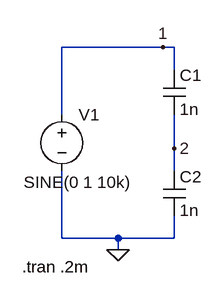
[diagram p0: schematic Fig_1-13_DC_float.asc]
Fig_1-13_DC_float.asc, the LTspice schematic file:
Version 4
SHEET 1 880 680
WIRE 224 16 80 16
WIRE 240 16 224 16
WIRE 240 48 240 16
WIRE 80 112 80 16
WIRE 240 160 240 112
WIRE 240 192 240 160
WIRE 80 288 80 192
WIRE 160 288 80 288
WIRE 240 288 240 256
WIRE 240 288 160 288
WIRE 160 304 160 288
FLAG 160 304 0
FLAG 224 16 1
FLAG 240 160 2
SYMBOL voltage 80 96 R0
WINDOW 3 -54 112 Left 2
WINDOW 123 0 0 Left 2
WINDOW 39 0 0 Left 2
SYMATTR Value SINE(0 1 10k)
SYMATTR InstName V1
SYMBOL cap 224 48 R0
SYMATTR InstName C1
SYMATTR Value 1n
SYMBOL cap 224 192 R0
SYMATTR InstName C2
SYMATTR Value 1n
TEXT 24 328 Left 2 !.tran .2m

The netlist it stands for:
* Fig_1-13_DC_float.asc
V1 1 0 SINE(0 1 10k)
C1 1 2 1n
C2 2 0 1n
.tran .2m
.backanno
.end

* Results of the author's LTspice run, read from the files saved beside the schematic
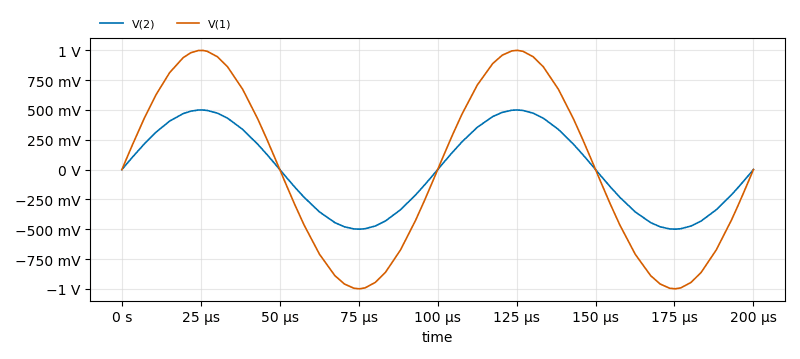
[diagram p1: Transient Analysis of Fig_1-13_DC_float.asc, plotted from the saved traces]
* Transient Analysis, 1 run:
*   V(2): min -499.9 mV, max 499.9 mV, average 24.99 µV, rms 353.5 mV, last 0 V
*   V(1): min -999.9 mV, max 999.9 mV, average 50 µV, rms 707 mV, last 0 V